# Altium schematic sheet limit_switches_connector.SchDoc
size A4; SheetNumber: 8; SheetTotal: 10
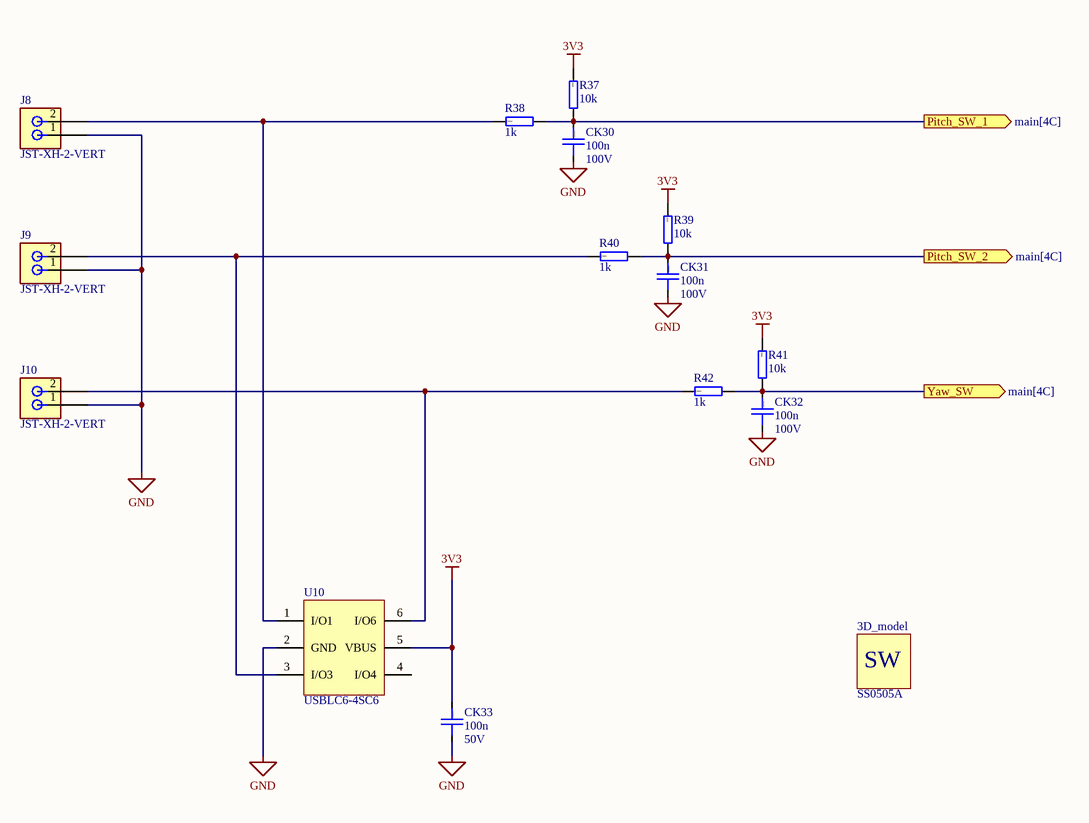
[diagram p0: limit_switches_connector.SchDoc]

## Parts
3D_model  SS0505A  [limit_sw_model]
CK30  100n  Voltage rating: 100V  [CAP0805]
CK31  100n  Voltage rating: 100V  [CAP0805]
CK32  100n  Voltage rating: 100V  [CAP0805]
CK33  100n  Voltage rating: 50V  [CAP0603]
J8  JST-XH-2-VERT  [JST-XH-2p-vert]
J9  JST-XH-2-VERT  [JST-XH-2p-vert]
J10  JST-XH-2-VERT  [JST-XH-2p-vert]
R37  10k  [RESC2012X06N(SMR0805)]
R38  1k  [RESC2012X06N(SMR0805)]
R39  10k  [RESC2012X06N(SMR0805)]
R40  1k  [RESC2012X06N(SMR0805)]
R41  10k  [RESC2012X06N(SMR0805)]
R42  1k  [RESC2012X06N(SMR0805)]
U10  USBLC6-4SC6  [SOT23-6]

## Ports
Pitch_SW_1 (out, see main[4C]), Pitch_SW_2 (out, see main[4C]), Yaw_SW (out, see main[4C])

## Nets
3V3: CK33.1 R37.2 R39.2 R41.2 U10.5(VBUS)
GND: CK30.2 CK31.2 CK32.2 CK33.2 J8.1 J9.1 J10.1 U10.2(GND)
Pitch_SW_1: CK30.1 R37.1 R38.1 ; port Pitch_SW_1
Pitch_SW_2: CK31.1 R39.1 R40.1 ; port Pitch_SW_2
Yaw_SW: CK32.1 R41.1 R42.1 ; port Yaw_SW
NetJ8_2: J8.2 R38.2 U10.1(I/O1)
NetJ9_2: J9.2 R40.2 U10.3(I/O3)
NetJ10_2: J10.2 R42.2 U10.6(I/O6)

Not connected (* = marked no-connect by the designer): U10 4(I/O4)

## Notes on the sheet
- (in symbol Cap 100n 100V 0805) 0805
- (in symbol Cap 100n 0603) 0603
- (in symbol model_only_limit_sw) SW

## Library data of the parts
3D_model = model_only_limit_sw: Mikrospínač SNAP ACTION; 3A/250VAC; s páčkou (s kladkou); SPDT; TME Part: WLK-4MINI/HE
CK30-CK32 = Cap 100n 100V 0805: 100V 100nF X7R ±10% 0805 Multilayer Ceramic Capacitors MLCC - SMD/SMT ROHS; Basic: Yes; Value: 100n; JLCPCB Part: C28233
CK33 = Cap 100n 0603: 50V 100nF X7R ±10% 0603 Multilayer Ceramic Capacitors MLCC - SMD/SMT ROHS; Basic: Yes; Value: 100n; JLCPCB Part: C14663
J8-J10 = JST-XH-2-VERT: Konektor: kabel-pl.spoj; zásuvka; vidlice; PIN: 2; XH; 3A; 250V; THT; Basic: No; TME Part: B2B-XH-A
R37 R39 R41 = Res 10k 0805: 125mW Thick Film Resistors 150V ±100ppm/℃ ±1% 10kΩ 0805 Chip Resistor - Surface Mount ROHS; Tolerance & Rating: 1%/0.1W; Basic: Yes; Value: 10k; Package: 0805; SMD: 1; ComponentLink3Description: rezistor čip; ComponentLink3URL: heliosgreen://v1/hegMT/5-MT/Classes(343)/Folders/OpenForm?RecordNumbers=[381513]; JLCPCB Part: C17414
R38 R40 R42 = Res 1k 0805: 125mW Thick Film Resistors 150V ±100ppm/℃ ±1% 1kΩ 0805 Chip Resistor - Surface Mount ROHS; Tolerance & Rating: 1%/0.1W; Basic: Yes; Value: 1k; Package: 0805; Author: JP/27.03.2014; SMD: 1; ComponentLink3Description: rezistor čip; ComponentLink3URL: heliosgreen://v1/hegMT/5-MT/Classes(343)/Folders/OpenForm?RecordNumbers=[381513]; JLCPCB Part: C17513
U10 = USBLC6-4SC6: 5A 17V 6V Unidirectional 5.25V SOT-23-6 ESD and Surge Protection (TVS/ESD) ROHS; Basic: No; JLCPCB Part: C111212; TME Part: USBLC6-4SC6